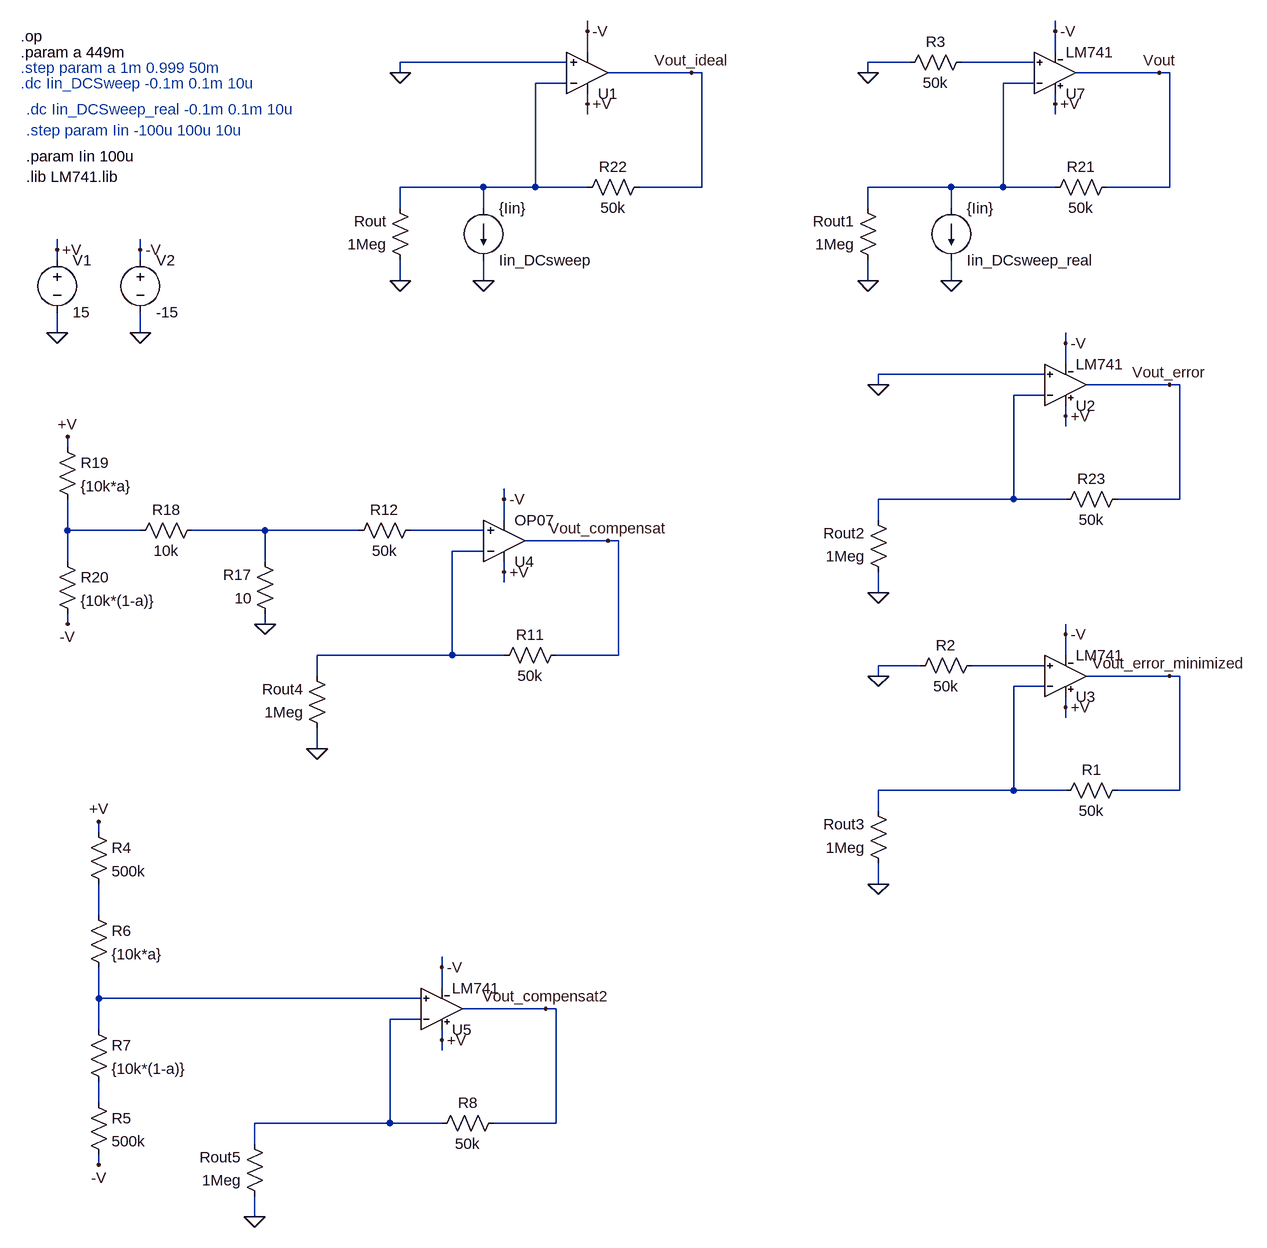
[diagram p0: schematic I_to_V_DC.asc]
I_to_V_DC.asc, the LTspice schematic file:
Version 4
SHEET 1 1076 2068
WIRE 32 224 32 208
WIRE 752 224 752 208
WIRE 32 256 32 224
WIRE 752 256 752 224
WIRE 0 272 -256 272
WIRE 528 272 464 272
WIRE 720 272 608 272
WIRE -256 288 -256 272
WIRE 192 288 64 288
WIRE 208 288 192 288
WIRE 464 288 464 272
WIRE 912 288 784 288
WIRE 928 288 912 288
WIRE 0 304 -48 304
WIRE 720 304 672 304
WIRE 32 336 32 320
WIRE 752 336 752 320
WIRE 32 352 32 336
WIRE 752 352 752 336
WIRE -128 464 -256 464
WIRE -48 464 -48 304
WIRE -48 464 -128 464
WIRE 32 464 -48 464
WIRE 208 464 208 288
WIRE 208 464 112 464
WIRE 592 464 464 464
WIRE 672 464 672 304
WIRE 672 464 592 464
WIRE 752 464 672 464
WIRE 928 464 928 288
WIRE 928 464 832 464
WIRE -256 496 -256 464
WIRE -128 496 -128 464
WIRE 464 496 464 464
WIRE 592 496 592 464
WIRE -784 560 -784 544
WIRE -656 560 -656 544
WIRE -784 576 -784 560
WIRE -656 576 -656 560
WIRE -256 608 -256 576
WIRE -128 608 -128 576
WIRE 464 608 464 576
WIRE 592 608 592 576
WIRE -784 688 -784 656
WIRE -656 688 -656 656
WIRE 768 704 768 688
WIRE 768 736 768 704
WIRE 736 752 480 752
WIRE 480 768 480 752
WIRE 928 768 800 768
WIRE 944 768 928 768
WIRE 736 784 688 784
WIRE 768 816 768 800
WIRE 768 832 768 816
WIRE -768 864 -768 848
WIRE -96 944 -96 928
WIRE 688 944 688 784
WIRE 688 944 480 944
WIRE 768 944 688 944
WIRE 944 944 944 768
WIRE 944 944 848 944
WIRE -96 976 -96 944
WIRE 480 976 480 944
WIRE -768 992 -768 944
WIRE -656 992 -768 992
WIRE -464 992 -576 992
WIRE -320 992 -464 992
WIRE -128 992 -240 992
WIRE 64 1008 -64 1008
WIRE 80 1008 64 1008
WIRE -128 1024 -176 1024
WIRE -768 1040 -768 992
WIRE -464 1040 -464 992
WIRE -96 1056 -96 1040
WIRE -96 1072 -96 1056
WIRE 480 1088 480 1056
WIRE -768 1136 -768 1120
WIRE -464 1136 -464 1120
WIRE 768 1152 768 1136
WIRE -176 1184 -176 1024
WIRE -176 1184 -384 1184
WIRE -96 1184 -176 1184
WIRE 80 1184 80 1008
WIRE 80 1184 -16 1184
WIRE 768 1184 768 1152
WIRE 544 1200 480 1200
WIRE 736 1200 624 1200
WIRE -384 1216 -384 1184
WIRE 480 1216 480 1200
WIRE 928 1216 800 1216
WIRE 944 1216 928 1216
WIRE 736 1232 688 1232
WIRE 768 1264 768 1248
WIRE 768 1280 768 1264
WIRE -384 1328 -384 1296
WIRE 688 1392 688 1232
WIRE 688 1392 480 1392
WIRE 768 1392 688 1392
WIRE 944 1392 944 1216
WIRE 944 1392 848 1392
WIRE 480 1424 480 1392
WIRE -720 1456 -720 1440
WIRE 480 1536 480 1504
WIRE -720 1584 -720 1536
WIRE -192 1664 -192 1648
WIRE -192 1696 -192 1664
WIRE -720 1712 -720 1664
WIRE -224 1712 -720 1712
WIRE -32 1728 -160 1728
WIRE -16 1728 -32 1728
WIRE -224 1744 -272 1744
WIRE -720 1760 -720 1712
WIRE -192 1776 -192 1760
WIRE -192 1792 -192 1776
WIRE -720 1872 -720 1840
WIRE -272 1904 -272 1744
WIRE -272 1904 -480 1904
WIRE -192 1904 -272 1904
WIRE -16 1904 -16 1728
WIRE -16 1904 -112 1904
WIRE -480 1936 -480 1904
WIRE -720 1968 -720 1952
WIRE -480 2048 -480 2016
FLAG -784 688 0
FLAG -656 688 0
FLAG -784 560 +V
FLAG -656 560 -V
FLAG -464 1136 0
FLAG -768 848 +V
FLAG -768 1136 -V
FLAG -256 288 0
FLAG -256 608 0
FLAG 192 288 Vout_ideal
FLAG -128 608 0
FLAG 752 336 +V
FLAG 752 224 -V
FLAG 464 288 0
FLAG 464 608 0
FLAG 912 288 Vout
FLAG 592 608 0
FLAG 32 336 +V
FLAG 32 224 -V
FLAG 768 816 +V
FLAG 768 704 -V
FLAG 480 768 0
FLAG 480 1088 0
FLAG 928 768 Vout_error
FLAG 768 1264 +V
FLAG 768 1152 -V
FLAG 480 1216 0
FLAG 480 1536 0
FLAG 928 1216 Vout_error_minimized
FLAG -96 1056 +V
FLAG -96 944 -V
FLAG -384 1328 0
FLAG 64 1008 Vout_compensat
FLAG -720 1440 +V
FLAG -720 1968 -V
FLAG -192 1776 +V
FLAG -192 1664 -V
FLAG -480 2048 0
FLAG -32 1728 Vout_compensat2
DATAFLAG -704 992 ""
DATAFLAG 208 368 ""
DATAFLAG 928 368 ""
DATAFLAG 944 848 ""
DATAFLAG 944 1296 ""
DATAFLAG 80 1088 ""
DATAFLAG -656 1712 ""
DATAFLAG -16 1808 ""
SYMBOL voltage -784 560 R0
WINDOW 123 0 0 Left 2
WINDOW 39 0 0 Left 2
SYMATTR InstName V1
SYMATTR Value 15
SYMBOL voltage -656 560 R0
WINDOW 123 0 0 Left 2
WINDOW 39 0 0 Left 2
SYMATTR InstName V2
SYMATTR Value -15
SYMBOL res -448 1136 R180
WINDOW 0 36 76 Left 2
WINDOW 3 36 40 Left 2
SYMATTR InstName R17
SYMATTR Value 10
SYMBOL res -672 1008 R270
WINDOW 0 32 56 VTop 2
WINDOW 3 0 56 VBottom 2
SYMATTR InstName R18
SYMATTR Value 10k
SYMBOL res -784 848 R0
SYMATTR InstName R19
SYMATTR Value {10k*a}
SYMBOL res -784 1024 R0
SYMATTR InstName R20
SYMATTR Value {10k*(1-a)}
SYMBOL res 128 448 R90
WINDOW 0 0 56 VBottom 2
WINDOW 3 32 56 VTop 2
SYMATTR InstName R22
SYMATTR Value 50k
SYMBOL res -240 592 R180
WINDOW 0 36 76 Left 2
WINDOW 3 36 40 Left 2
SYMATTR InstName Rout
SYMATTR Value 1Meg
SYMBOL current -128 496 R0
WINDOW 0 24 80 Left 2
WINDOW 3 24 0 Left 2
WINDOW 123 0 0 Left 0
WINDOW 39 0 0 Left 0
SYMATTR InstName Iin_DCsweep
SYMATTR Value {Iin}
SYMBOL res 848 448 R90
WINDOW 0 0 56 VBottom 2
WINDOW 3 32 56 VTop 2
SYMATTR InstName R21
SYMATTR Value 50k
SYMBOL res 480 592 R180
WINDOW 0 36 76 Left 2
WINDOW 3 36 40 Left 2
SYMATTR InstName Rout1
SYMATTR Value 1Meg
SYMBOL current 592 496 R0
WINDOW 0 24 80 Left 2
WINDOW 3 24 0 Left 2
WINDOW 123 0 0 Left 0
WINDOW 39 0 0 Left 0
SYMATTR InstName Iin_DCsweep_real
SYMATTR Value {Iin}
SYMBOL OpAmps\\UniversalOpamp 32 288 M180
SYMATTR InstName U1
SYMBOL res 864 928 R90
WINDOW 0 0 56 VBottom 2
WINDOW 3 32 56 VTop 2
SYMATTR InstName R23
SYMATTR Value 50k
SYMBOL res 496 1072 R180
WINDOW 0 36 76 Left 2
WINDOW 3 36 40 Left 2
SYMATTR InstName Rout2
SYMATTR Value 1Meg
SYMBOL res 864 1376 R90
WINDOW 0 0 56 VBottom 2
WINDOW 3 32 56 VTop 2
SYMATTR InstName R1
SYMATTR Value 50k
SYMBOL res 640 1184 R90
WINDOW 0 0 56 VBottom 2
WINDOW 3 32 56 VTop 2
SYMATTR InstName R2
SYMATTR Value 50k
SYMBOL res 496 1520 R180
WINDOW 0 36 76 Left 2
WINDOW 3 36 40 Left 2
SYMATTR InstName Rout3
SYMATTR Value 1Meg
SYMBOL res 624 256 R90
WINDOW 0 0 56 VBottom 2
WINDOW 3 32 56 VTop 2
SYMATTR InstName R3
SYMATTR Value 50k
SYMBOL res 0 1168 R90
WINDOW 0 0 56 VBottom 2
WINDOW 3 32 56 VTop 2
SYMATTR InstName R11
SYMATTR Value 50k
SYMBOL res -224 976 R90
WINDOW 0 0 56 VBottom 2
WINDOW 3 32 56 VTop 2
SYMATTR InstName R12
SYMATTR Value 50k
SYMBOL res -368 1312 R180
WINDOW 0 36 76 Left 2
WINDOW 3 36 40 Left 2
SYMATTR InstName Rout4
SYMATTR Value 1Meg
SYMBOL res -736 1568 R0
SYMATTR InstName R6
SYMATTR Value {10k*a}
SYMBOL res -736 1744 R0
SYMATTR InstName R7
SYMATTR Value {10k*(1-a)}
SYMBOL res -96 1888 R90
WINDOW 0 0 56 VBottom 2
WINDOW 3 32 56 VTop 2
SYMATTR InstName R8
SYMATTR Value 50k
SYMBOL res -464 2032 R180
WINDOW 0 36 76 Left 2
WINDOW 3 36 40 Left 2
SYMATTR InstName Rout5
SYMATTR Value 1Meg
SYMBOL res -736 1440 R0
SYMATTR InstName R4
SYMATTR Value 500k
SYMBOL res -736 1856 R0
SYMATTR InstName R5
SYMATTR Value 500k
SYMBOL OpAmps\\OP07 -96 1072 M180
SYMATTR InstName U4
SYMBOL LM741 752 352 M180
SYMATTR InstName U7
SYMBOL LM741 768 832 M180
SYMATTR InstName U2
SYMBOL LM741 768 1280 M180
SYMATTR InstName U3
SYMBOL LM741 -192 1792 M180
SYMATTR InstName U5
TEXT -832 448 Left 2 !.lib LM741.lib
TEXT -840 232 Left 2 !.op
TEXT -840 280 Left 2 ;.step param a 1m 0.999 50m
TEXT -840 304 Left 2 ;.dc Iin_DCSweep -0.1m 0.1m 10u
TEXT -840 256 Left 2 !.param a 449m
TEXT -832 344 Left 2 ;.dc Iin_DCSweep_real -0.1m 0.1m 10u
TEXT -832 376 Left 2 ;.step param Iin -100u 100u 10u
TEXT -832 416 Left 2 !.param Iin 100u

The netlist it stands for:
* I_to_V_DC.asc
V1 +V 0 15
V2 -V 0 -15
R17 0 N006 10
R18 N005 N006 10k
R19 +V N005 {10k*a}
R20 N005 -V {10k*(1-a)}
R22 Vout_ideal N002 50k
Rout 0 N002 1Meg
Iin_DCsweep N002 0 {Iin}
R21 Vout N003 50k
Rout1 0 N003 1Meg
Iin_DCsweep_real N003 0 {Iin}
XU1 0 N002 +V -V Vout_ideal level1 Avol=1Meg GBW=10Meg Vos=0 En=0 Enk=0 In=0 Ink=0 Rin=500Meg  ; pins In+ In- V+ V- OUT
R23 Vout_error N004 50k
Rout2 0 N004 1Meg
R1 Vout_error_minimized N010 50k
R2 N009 0 50k
Rout3 0 N010 1Meg
R3 N001 0 50k
R11 Vout_compensat N008 50k
R12 N007 N006 50k
Rout4 0 N008 1Meg
R6 N011 N012 {10k*a}
R7 N012 N014 {10k*(1-a)}
R8 Vout_compensat2 N013 50k
Rout5 0 N013 1Meg
R4 +V N011 500k
R5 N014 -V 500k
XU4 N007 N008 +V -V Vout_compensat LT1001  ; OP07, pins In+ In- V+ V- OUT
XU7 N001 N003 +V -V Vout LM741  ; pins In+ In- V+ V- OUT
XU2 0 N004 +V -V Vout_error LM741  ; pins In+ In- V+ V- OUT
XU3 N009 N010 +V -V Vout_error_minimized LM741  ; pins In+ In- V+ V- OUT
XU5 N012 N013 +V -V Vout_compensat2 LM741  ; pins In+ In- V+ V- OUT
.lib LM741.lib
.op
* .step param a 1m 0.999 50m
* .dc Iin_DCSweep -0.1m 0.1m 10u
.param a 449m
* .dc Iin_DCSweep_real -0.1m 0.1m 10u
* .step param Iin -100u 100u 10u
.param Iin 100u
.lib UniversalOpAmp1.lib
.lib LTC.lib
.lib LM741.lib
.backanno
.end